# EAGLE schematic Arduino-Teensy-v421_PLUS_ESP-12E (EAGLE 8.1.0)
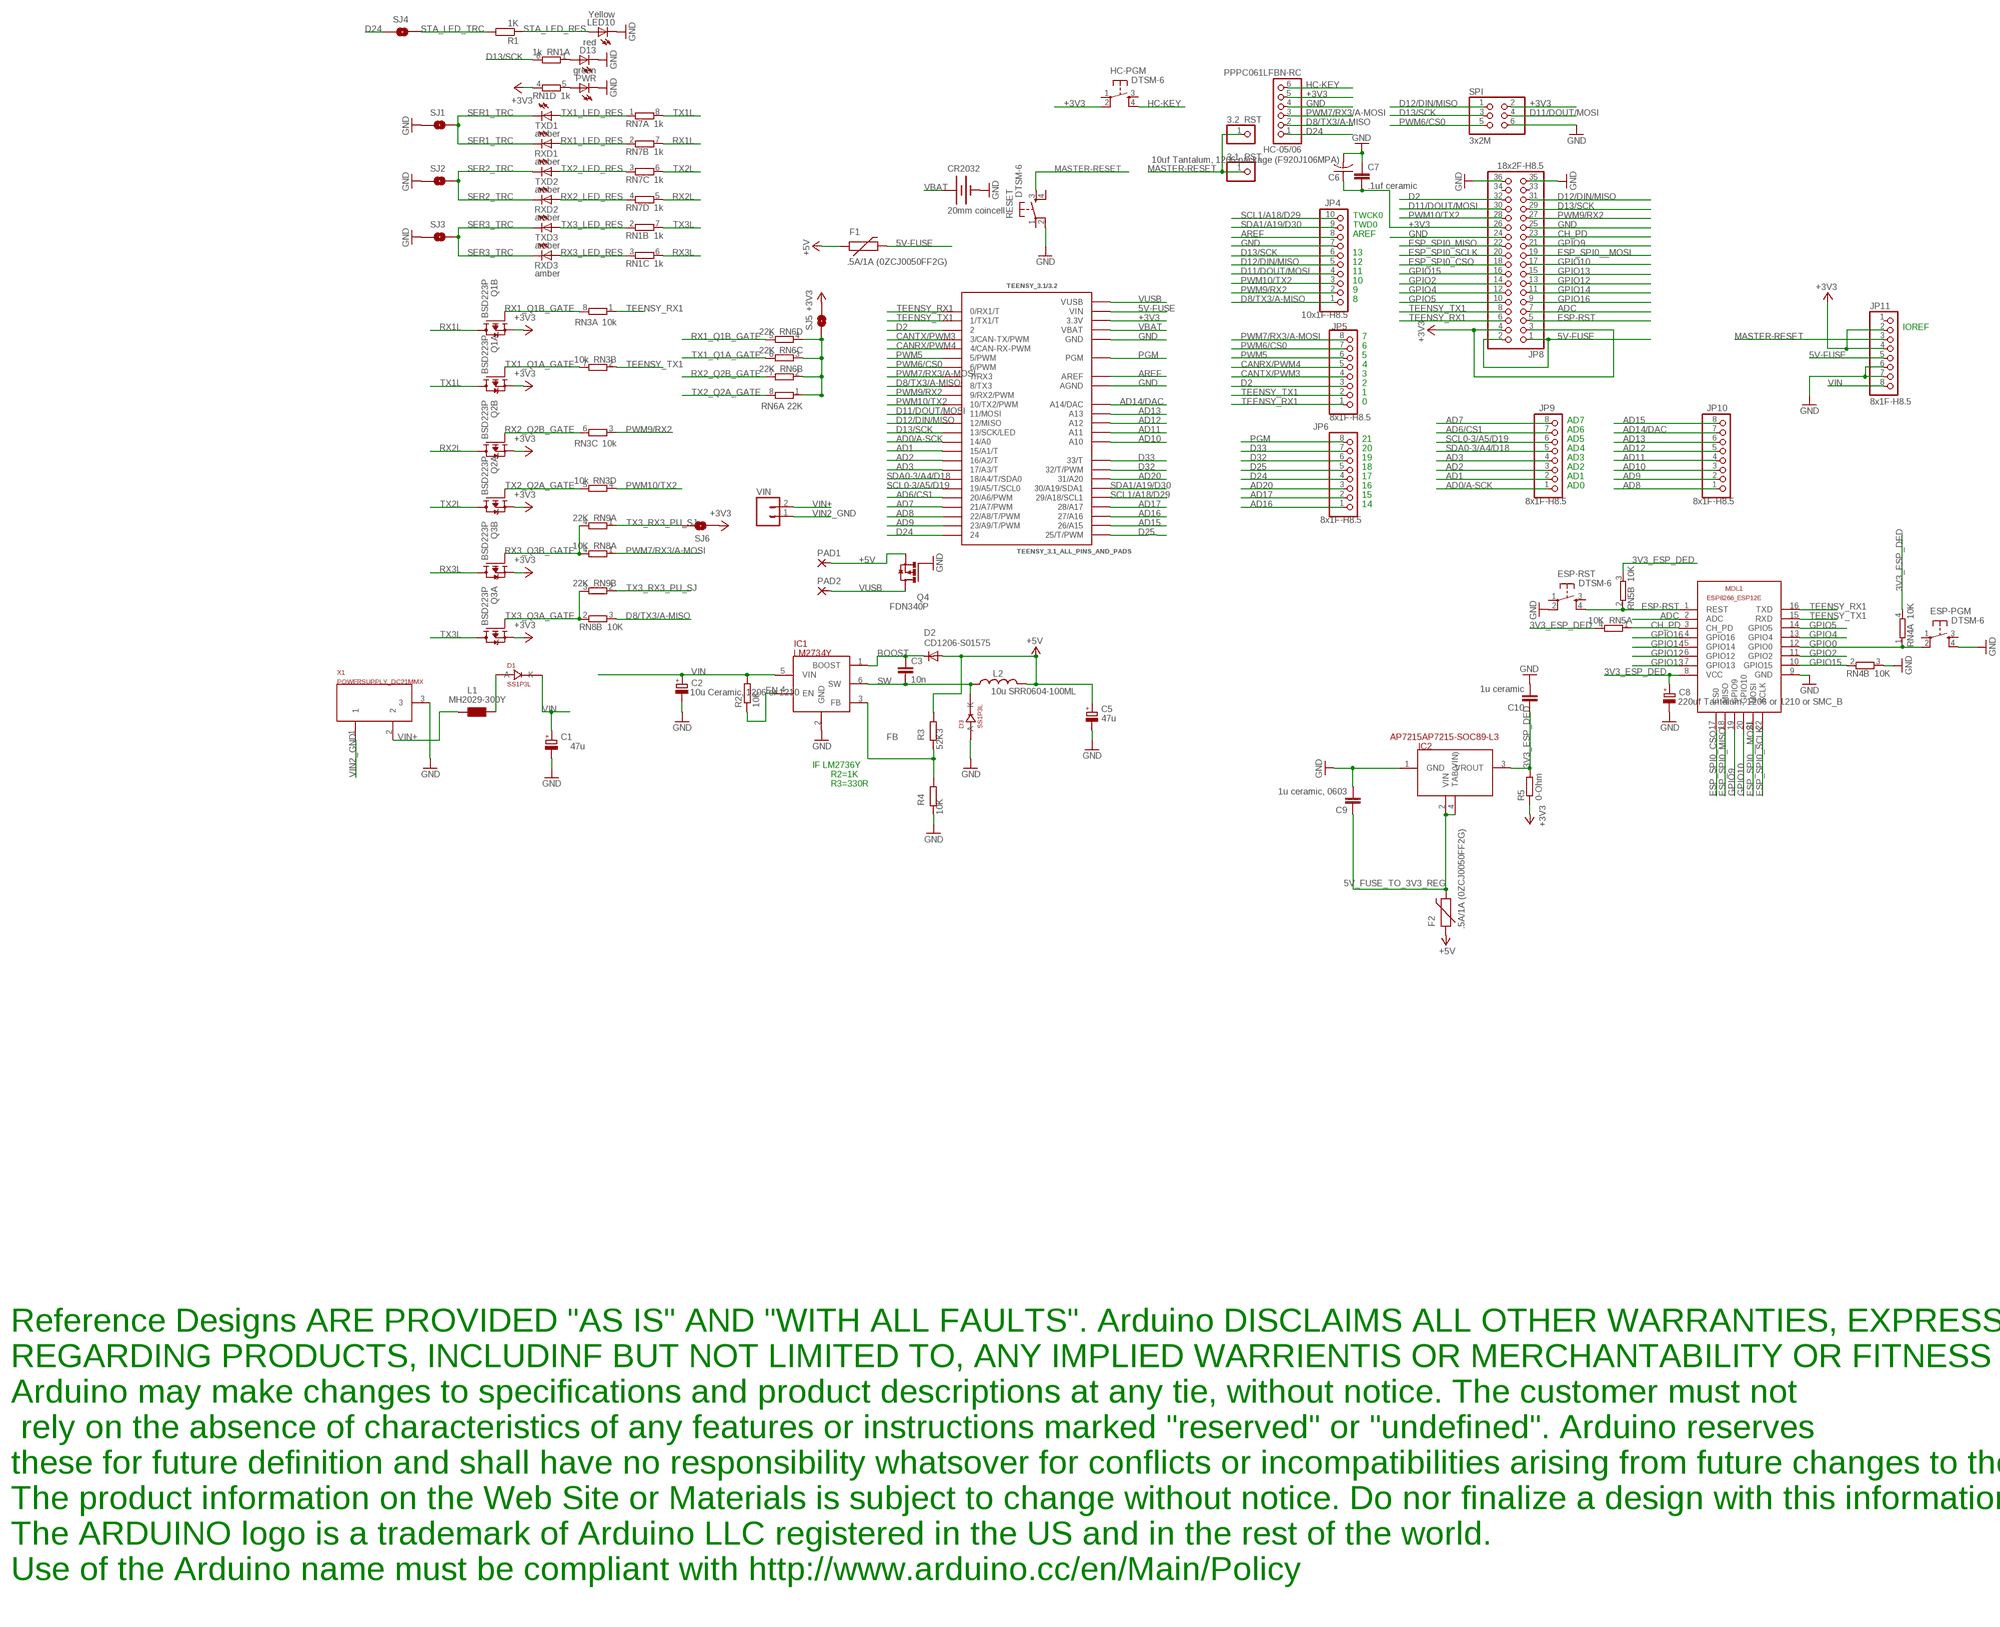
[diagram p0: schematic, sheet 1, part 1 of 2]
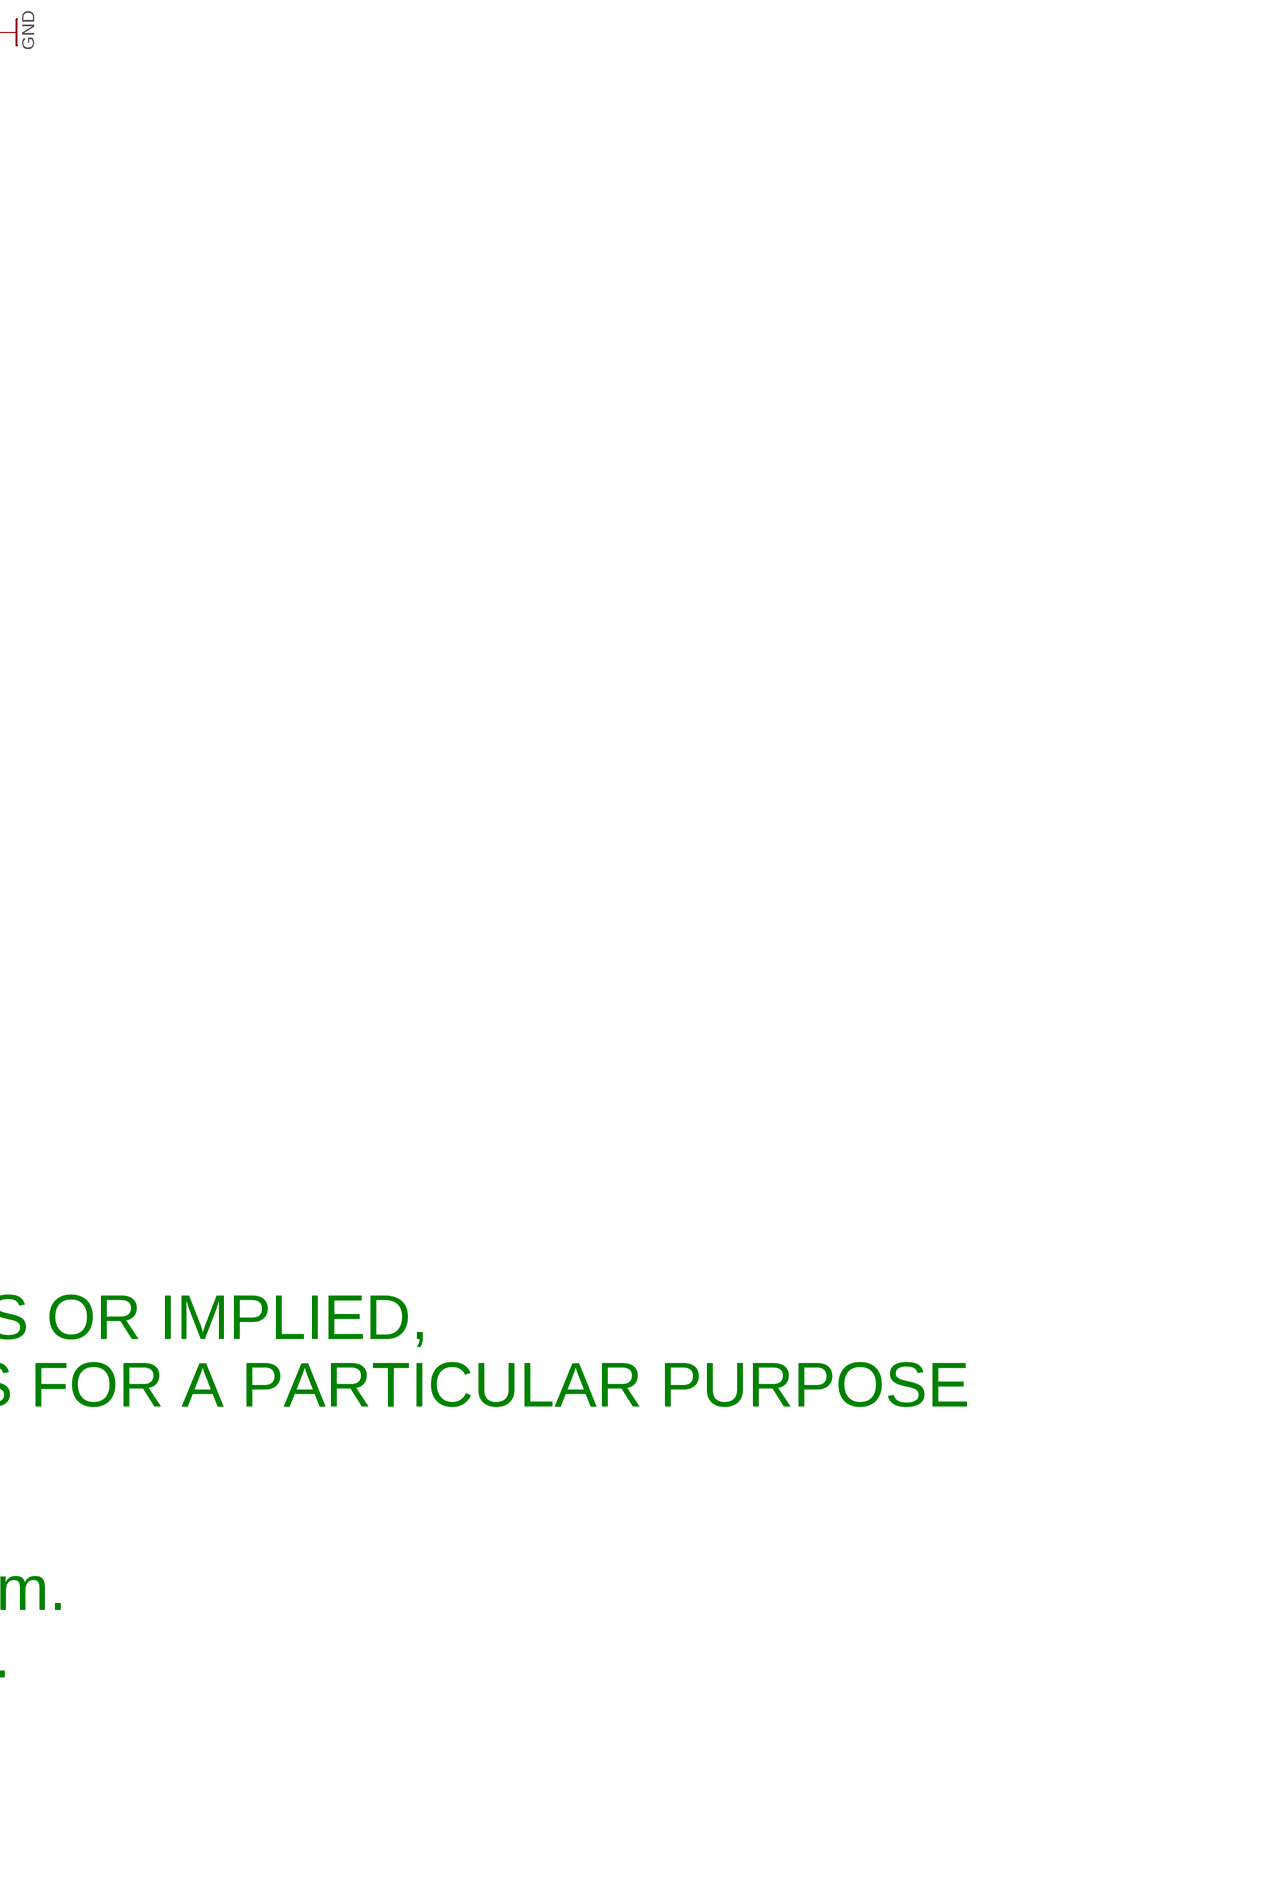
[diagram p1: schematic, sheet 1, part 2 of 2]

## Parts
3.1_RST  PINHD-1X1CB  [1X01-CLEANBIG]
3.2_RST  PINHD-1X1CB  [1X01-CLEANBIG]
C1  47u  CPOL-EUD  [PANASONIC_D]
C2  10u Ceramic, 1206 or 1210  CPOL-EUSMCB  [SMC_B]
C3  10n  C-EUC0603  [C0603-ROUND]
C5  47u  CPOL-EUD  [PANASONIC_D]
C6  10uf Tantalum, 1206 package (F920J106MPA)  C-USC0805  [C0805]
C7  .1uf ceramic  C-EUC0603  [C0603-ROUND]
C8  220uf Tantalum, 1206 or 1210 or SMC_B  CPOL-EUSMCB  [SMC_B]
C9  1u ceramic, 0603  C-EUC0603  [C0603-ROUND]
C10  1u ceramic  C-EUC0603  [C0603-ROUND]
CR2032  20mm coincell  BATTERY20MM_4LEGS  [BATTCON_20MM_4LEGS]
D1  SS1P3L  [DO220AAL]
D2  CD1206-S01575  DIODE-MINIMELF  [MINIMELF]
D3  SS1P3L  [DO220AAL]
D13  red  LEDCHIPLED_0805  [CHIPLED_0805]
ESP-PGM  DTSM-6  [DTSM-6]
ESP-RST  DTSM-6  [DTSM-6]
F1  .5A/1A (0ZCJ0050FF2G)  PTCSMD  [PTC-1206]
F2  .5A/1A (0ZCJ0050FF2G)  PTCSMD  [PTC-1206]
HC-05/06  PPPC061LFBN-RC  PINHD-1X6  [1X06]
HC-PGM  DTSM-6  [DTSM-6]
IC1  LM2734Y  LM2736Y  [SOT23-6]
IC2  AP7215AP7215-SOC89-L3  [SOC89-L3]
JP4  10x1F-H8.5  PINHD-1X10  [1X10]
JP5  8x1F-H8.5  PINHD-1X8  [1X08]
JP6  8x1F-H8.5  PINHD-1X8  [1X08]
JP8  18x2F-H8.5  PINHD-2X18  [2X18]
JP9  8x1F-H8.5  PINHD-1X8  [1X08]
JP10  8x1F-H8.5  PINHD-1X8  [1X08]
JP11  8x1F-H8.5  PINHD-1X8  [1X08]
L1  MH2029-300Y  WE-CBF_0805  [0805]
L2  10u SRR0604-100ML  L-USSRR0604  [SRR0604]
LED10  Yellow  LEDCHIPLED_0805  [CHIPLED_0805]
MDL1  ESP8266-12E)  ESP8266-12EESP8266-ESP12E  [ESP8266-ESP12E]
PAD1  SMD2  [SMD1,27-2,54]
PAD2  SMD2  [SMD1,27-2,54]
PWR  green  LEDCHIPLED_0805  [CHIPLED_0805]
Q1  BSD223P  [SOT363_INFINEON]
Q2  BSD223P  [SOT363_INFINEON]
Q3  BSD223P  [SOT363_INFINEON]
Q4  FDN340P  FDN360P  [SUPER-SOT3]
R1  1K  R-EU_R0603  [R0603]
R2  10K  R-EU_R0603  [R0603]
R3  52K3  R-EU_0603-RND  [R0603-ROUND]
R4  10K  R-EU_0603-RND  [R0603-ROUND]
R5  0-Ohm  R-EU_R0603  [R0603]
RESET  DTSM-6  [DTSM-6]
RN1  1k  4R-NCAT16  [CAT16]
RN3  10k  4R-NCAT16  [CAT16]
RN4  10K  2R-NEXB34V  [EXB34V]
RN5  10K  2R-NEXB34V  [EXB34V]
RN6  22K  4R-NCAT16  [CAT16]
RN7  1k  4R-NCAT16  [CAT16]
RN8  10K  2R-NEXB34V  [EXB34V]
RN9  22K  2R-NEXB34V  [EXB34V]
RXD1  amber  LEDCHIPLED_0805  [CHIPLED_0805]
RXD2  amber  LEDCHIPLED_0805  [CHIPLED_0805]
RXD3  amber  LEDCHIPLED_0805  [CHIPLED_0805]
SJ1  SOLDERJUMPERTRACE  [SJ_2S-TRACE]
SJ2  SOLDERJUMPERTRACE  [SJ_2S-TRACE]
SJ3  SOLDERJUMPERTRACE  [SJ_2S-TRACE]
SJ4  SOLDERJUMPERTRACE  [SJ_2S-TRACE]
SJ5  SOLDERJUMPERTRACE  [SJ_2S-TRACE]
SJ6  SOLDERJUMPERTRACE  [SJ_2S-TRACE]
SPI  3x2M  PINHD-2X3  [2X03]
TEENSY_3.1/3.2  TEENSY_3.1_ALL_PINS_AND_PADS  [TEENSY3_ALL_PINS_&_PADS]
TXD1  amber  LEDCHIPLED_0805  [CHIPLED_0805]
TXD2  amber  LEDCHIPLED_0805  [CHIPLED_0805]
TXD3  amber  LEDCHIPLED_0805  [CHIPLED_0805]
VIN  M02LOCK_LONGPADS  [1X02_LOCK_LONGPADS]
X1  POWERSUPPLY_DC21MMX  [POWERSUPPLY_DC-21MM]

## Nets
3V3_ESP_DED: C8.+ C10.1 IC2.3(VROUT) MDL1.8(VCC) R5.2 RN4.4 RN5.3 RN5.4
5V-FUSE [POWER]: F1.2 JP8.1 JP8.2 JP11.5 TEENSY_3.1/3.2.VIN
5V_FUSE_TO_3V3_REG [POWER]: C9.1 F2.2 IC2.2(VIN) IC2.4(TAB(VIN))
+3V3 [POWER]: C6.1 C7.2 HC-05/06.5 HC-PGM.2 JP8.3 JP8.4 JP8.26 JP11.2 JP11.4 Q1.1(A:S) Q1.4(B:S) Q2.1(A:S) Q2.4(B:S) Q3.1(A:S) Q3.4(B:S) R5.1 RN1.4 SJ5.2 SJ6.1 SPI.2 TEENSY_3.1/3.2.3.3V TEENSY_3.1/3.2.3.3V1(3.3V) TEENSY_3.1/3.2.3.3V2(3.3V)
+5V [POWER]: C5.+ D2.A F1.1 F2.1 L2.P$2 PAD1.1(P) Q4.2(S) R3.1
AD0/A-SCK: JP9.1 TEENSY_3.1/3.2.14/A0
AD1: JP9.2 TEENSY_3.1/3.2.15/A1(15/A1/T)
AD2: JP9.3 TEENSY_3.1/3.2.16/A2(16/A2/T)
AD3: JP9.4 TEENSY_3.1/3.2.17/A3(17/A3/T)
AD6/CS1: JP9.7 TEENSY_3.1/3.2.20/A6(20/A6/PWM)
AD7: JP9.8 TEENSY_3.1/3.2.21/A7(21/A7/PWM)
AD8: JP10.1 TEENSY_3.1/3.2.22/A8(22/A8/T/PWM)
AD9: JP10.2 TEENSY_3.1/3.2.23/A9(23/A9/T/PWM)
AD10: JP10.3 TEENSY_3.1/3.2.A10
AD11: JP10.4 TEENSY_3.1/3.2.A11
AD12: JP10.5 TEENSY_3.1/3.2.A12
AD13: JP10.6 TEENSY_3.1/3.2.A13
AD14/DAC: JP10.7 TEENSY_3.1/3.2.RESET/DAC(A14/DAC)
AD15: JP10.8 TEENSY_3.1/3.2.26(26/A15)
AD16: JP6.1 TEENSY_3.1/3.2.27(27/A16)
AD17: JP6.2 TEENSY_3.1/3.2.28(28/A17)
AD20: JP6.3 TEENSY_3.1/3.2.31(31/A20)
ADC: JP8.7 MDL1.2(ADC)
AREF: JP4.8 TEENSY_3.1/3.2.AREF
BOOST: C3.1 D2.C IC1.1(BOOST)
CANRX/PWM4: JP5.5 TEENSY_3.1/3.2.4(4/CAN-RX-PWM)
CANTX/PWM3: JP5.4 TEENSY_3.1/3.2.3(3/CAN-TX/PWM)
CH_PD: JP8.23 MDL1.3(CH_PD) RN5.1
D2: JP5.3 JP8.32 TEENSY_3.1/3.2.2
D8/TX3/A-MISO: HC-05/06.2 JP4.1 RN8.3 TEENSY_3.1/3.2.8(8/TX3)
D11/DOUT/MOSI: JP4.4 JP8.30 SPI.4 TEENSY_3.1/3.2.11(11/MOSI)
D12/DIN/MISO: JP4.5 JP8.31 SPI.1 TEENSY_3.1/3.2.12(12/MISO)
D13/SCK: JP4.6 JP8.29 RN1.8 SPI.3 TEENSY_3.1/3.2.13(13/SCK/LED)
D24: HC-05/06.1 JP6.4 SJ4.1 TEENSY_3.1/3.2.24
D25: JP6.5 TEENSY_3.1/3.2.25(25/T/PWM)
D32: JP6.6 TEENSY_3.1/3.2.32(32/T/PWM)
D33: JP6.7 TEENSY_3.1/3.2.33(33/T)
EN: IC1.4(EN) R2.1
ESP-RST: ESP-RST.4 JP8.5 MDL1.1(REST) RN5.2
ESP_SPI0__MOSI: JP8.19 MDL1.21(MOSI)
ESP_SPI0_CSO: JP8.18 MDL1.17(CS0)
ESP_SPI0_MISO: JP8.22 MDL1.18(MISO)
ESP_SPI0_SCLK: JP8.20 MDL1.22(SCLK)
FB: IC1.3(FB) R3.2 R4.1
GND: C1.- C2.- C5.- C6.2 C7.1 C8.- C9.2 C10.2 CR2032.NEGATIVE(-) D3.P$2(A) D13.C ESP-PGM.4 ESP-RST.2 HC-05/06.4 IC1.2(GND) IC2.1(GND) JP4.7 JP8.24 JP8.25 JP8.35 JP8.36 JP11.6 JP11.7 LED10.C MDL1.9(GND) PWR.C Q4.1(G) R4.2 RESET.2 RN4.3 SJ1.1 SJ2.1 SJ3.1 SPI.6 TEENSY_3.1/3.2.AGND TEENSY_3.1/3.2.GND TEENSY_3.1/3.2.GND1(GND) TEENSY_3.1/3.2.GND2(GND) X1.3
GPIO0: ESP-PGM.2 MDL1.12(GPIO0) RN4.1
GPIO2: JP8.14 MDL1.11(GPIO2)
GPIO4: JP8.12 MDL1.13(GPIO4)
GPIO5: JP8.10 MDL1.14(GPIO5)
GPIO9: JP8.21 MDL1.19(GPIO9)
GPIO10: JP8.17 MDL1.20(GPIO10)
GPIO12: JP8.13 MDL1.6(GPIO12)
GPIO13: JP8.15 MDL1.7(GPIO13)
GPIO14: JP8.11 MDL1.5(GPIO14)
GPIO15: JP8.16 MDL1.10(GPIO15) RN4.2
GPIO16: JP8.9 MDL1.4(GPIO16)
HC-KEY: HC-05/06.6 HC-PGM.4
MASTER-RESET: 3.1_RST.1 3.2_RST.1 JP11.3 RESET.3
N$2: PWR.A RN1.5
N$3: D13.A RN1.1
N$10 [POWER]: D1.P$2(A) L1.1
PGM: JP6.8 TEENSY_3.1/3.2.PGM
PWM5: JP5.6 TEENSY_3.1/3.2.5(5/PWM)
PWM6/CS0: JP5.7 SPI.5 TEENSY_3.1/3.2.6(6/PWM)
PWM7/RX3/A-MOSI: HC-05/06.3 JP5.8 RN8.1 TEENSY_3.1/3.2.7(7/RX3)
PWM9/RX2: JP4.2 JP8.27 RN3.3 TEENSY_3.1/3.2.9(9/RX2/PWM)
PWM10/TX2: JP4.3 JP8.28 RN3.4 TEENSY_3.1/3.2.10(10/TX2/PWM)
RX1_LED_RES: RN7.2 RXD1.A
RX1_Q1B_GATE: Q1.5(B:G) RN3.8 RN6.5
RX1_TX1_RX2_TX2_PU_SJ: RN6.1 RN6.2 RN6.3 RN6.4 SJ5.1
RX1L: Q1.3(B:D) RN7.7
RX2_LED_RES: RN7.4 RXD2.A
RX2_Q2B_GATE: Q2.5(B:G) RN3.6 RN6.7
RX2L: Q2.3(B:D) RN7.5
RX3_LED_RES: RN1.3 RXD3.A
RX3_Q3B_GATE: Q3.5(B:G) RN8.4 RN9.4
RX3L: Q3.3(B:D) RN1.6
SCL0-3/A5/D19: JP9.6 TEENSY_3.1/3.2.19/A5(19/A5/T/SCL0)
SCL1/A18/D29: JP4.10 TEENSY_3.1/3.2.29(29/A18/SCL1)
SDA0-3/A4/D18: JP9.5 TEENSY_3.1/3.2.18/A4(18/A4/T/SDA0)
SDA1/A19/D30: JP4.9 TEENSY_3.1/3.2.30(30/A19/SDA1)
SER1_TRC: RXD1.C SJ1.2 TXD1.C
SER2_TRC: RXD2.C SJ2.2 TXD2.C
SER3_TRC: RXD3.C SJ3.2 TXD3.C
STA_LED_RES: LED10.A R1.1
STA_LED_TRC: R1.2 SJ4.2
SW: C3.2 D3.P$1(K) IC1.6(SW) L2.P$1
TEENSY_RX1: JP5.1 JP8.6 MDL1.16(TXD) RN3.1 TEENSY_3.1/3.2.0(0/RX1/T)
TEENSY_TX1: JP5.2 JP8.8 MDL1.15(RXD) RN3.2 TEENSY_3.1/3.2.1(1/TX1/T)
TX1_LED_RES: RN7.1 TXD1.A
TX1_Q1A_GATE: Q1.2(A:G) RN3.7 RN6.6
TX1L: Q1.6(A:D) RN7.8
TX2_LED_RES: RN7.3 TXD2.A
TX2_Q2A_GATE: Q2.2(A:G) RN3.5 RN6.8
TX2L: Q2.6(A:D) RN7.6
TX3_LED_RES: RN1.2 TXD3.A
TX3_Q3A_GATE: Q3.2(A:G) RN8.2 RN9.3
TX3_RX3_PU_SJ: RN9.1 RN9.2 SJ6.2
TX3L: Q3.6(A:D) RN1.7
VBAT: CR2032.POSITIVE@1(+) CR2032.POSITIVE@2(+) CR2032.POSITIVE@3(+) CR2032.POSITIVE@4(+) TEENSY_3.1/3.2.VBAT
VIN [POWER]: C1.+ C2.+ D1.P$1(K) IC1.5(VIN) JP11.8 R2.2
VIN2_GND: VIN.1 X1.1
VIN+ [POWER]: L1.2 VIN.2 X1.2
VUSB [POWER]: PAD2.1(P) Q4.3(D) TEENSY_3.1/3.2.VUSB
Unconnected: ESP-PGM.1 ESP-PGM.3 ESP-RST.1 ESP-RST.3 HC-PGM.1 HC-PGM.3 JP8.33 JP8.34 JP11.1 RESET.1 RESET.4

## Notes on the sheet
- TWCK0
- TWD0
- AREF
- 13
- 12
- 11
- 10
- 9
- 8
- IOREF
- 7
- 6
- 5
- 4
- 3
- 2
- 1
- 0
- AD7
- AD6
- 21 | AD5
- 20 | AD4
- 19 | AD3
- 18 | AD2
- 17 | AD1
- 16 | AD0
- 15
- 14
- IF LM2736Y
- R2=1K
- R3=330R
- Reference Designs ARE PROVIDED "AS IS" AND "WITH ALL FAULTS". Arduino DISCLAIMS ALL OTHER WARRANTIES, EXPRESS OR IMPLIED,
  REGARDING PRODUCTS, INCLUDINF BUT NOT LIMITED TO, ANY IMPLIED WARRIENTIS OR MERCHANTABILITY OR FITNESS FOR A PARTICULAR PURPOSE
  Arduino may make changes to specifications and product descriptions at any tie, without notice. The customer must not
   rely on the absence of characteristics of any features or instructions marked "reserved" or "undefined". Arduino reserves
  these for future definition and shall have no responsibility whatsover for conflicts or incompatibilities arising from future changes to them.
  The product information on the Web Site or Materials is subject to change without notice. Do nor finalize a design with this information.
  The ARDUINO logo is a trademark of Arduino LLC registered in the US and in the rest of the world.
  Use of the Arduino name must be compliant with http://www.arduino.cc/en/Main/Policy

## Library data of the parts
3.1_RST 3.2_RST = adafruit:PINHD-1X1: Pin header 1x1 for 0.1" spacing With round pins
C1 C2 C5 C8 = rcl:CPOL-EU: POLARIZED CAPACITOR, European symbol
C3 C7 C9 C10 = SmartPrj:C-EU: CAPACITOR, European symbol
C6 = rcl:C-US: CAPACITOR, American symbol
CR2032 = SparkFun-Electromechanical:BATTERY: Battery Holders Various common sizes : AA, AAA, 18650 (PRT-12895), 20mm coin cell and 12mm coin cell. 20MM_4LEGS, BATT-10373; PROD_ID: BATT-10373
D1 D3 = SmartPrj:SS1P3L
D2 = diode:DIODE-: DIODE
D13 LED10 PWR RXD1-RXD3 TXD1-TXD3 = adafruit:LED: LED OSRAM: - CHIPLED LG R971, LG N971, LY N971, LG Q971, LY Q971, LO R971, LY R971 LH N974, LH R974 LS Q976, LO Q976, LY Q976 LO Q996 - Hyper CHIPLED LW Q18S LB Q993, LB Q99A, LB R99A - SideLED LS A670, LO A670, LY A670, LG A670, LP A670 LB A673, LV A673, LT A673, LW A673 LH A674 LY A675 LS A676, LA A676, LO A676, LY A676, LW A676 LS A679, LY A679, LG A679 - Hyper Micro SIDELED® LS Y876, LA Y876, LO Y876, LY Y876 LT Y87S - SmartLED LW L88C, LW L88S LB L89C, LB L89S, LG L890 LS L89K, LO L89K, LY L89K LS L896, LA L896, LO L896, LY L896 - TOPLED LS T670, LO T670, LY T670, LG T670, LP T670 LSG T670, LSP T670, LSY T670, LOP T670, LYG T670 LG T671, LOG T671, LSG T671 LB T673, LV T673, LT T673, LW T673 LH T674 LS T676, LA T676, LO T676, LY T676, LB T676, LH T676, LSB T676, LW T676 LB T67C, LV T67C, LT T67C, LS T67K, LO T67K, LY T67K, LW E67C LS E67B, LA E67B, LO E67B, LY E67B, LB E67C, LV E67C, LT E67C LW T67C LS T679, LY T679, LG T679 LS T770, LO T770, LY T770, LG T770, LP T770 LB T773, LV T773, LT T773, LW T773 LH T774 LS E675, LA E675, LY E675, LS T675 LS T776, LA T776, LO T776, LY T776, LB T776 LHGB T686 LT T68C, LB T68C - Hyper Mini TOPLED® LB M676 - Mini TOPLED Santana® LG M470 LS M47K, LO M47K, LY M47K Source: http://www.osram.convergy.de/
ESP-PGM ESP-RST HC-PGM RESET = switch-tact:DTSM-6
F1 F2 = SparkFun:PTC: Resettable Fuse PTC Resettable Fuse. Spark Fun Electronics SKU : COM-08357
HC-05/06 = pinhead:PINHD-1X6: PIN HEADER
IC1 = SmartPrj:LM2736Y
IC2 = my-custom-lib:AP7215
JP4 = SmartPrj:PINHD-1X10: PIN HEADER
JP5 JP6 JP9-JP11 = SmartPrj:PINHD-1X8: PIN HEADER
JP8 = SmartPrj:PINHD-2X18: PIN HEADER
L1 = wuerth-elektronik:WE-CBF: SMD EMI Suppression Ferrite Beads - excellent anti-EMI properties - low DCR - impedances till 3000 ohms - rated current up to 6 A
L2 = SmartPrj:L-US: INDUCTOR, American symbol
MDL1 = ESP8266-ESP12E:ESP8266-12E: ESP8266-12E with additional I/O and GPIO04/05 corrected The author cannot warrant that this library is free from error or will meet your specific requirements. Created by PuceBaboon.com. Komagane, Nagano, JAPAN
PAD1 PAD2 = wirepad:SMD2: SMD PAD
Q1-Q3 = transistor-fet:BSD223P: OptiMOS(R)-P Small-Signal-Transistor Dual P-Channel, Enhancement mode, Super Logic Level (2.5 V rated) Source: http://www.infineon.com/upload/Document/BSD223P_Rev1.3.pdf
Q4 = transistor-power:FDN360P: Single P-Channel, PowerTrench (R) MOSFET Source: http://www.fairchildsemi.com/ds/FD/FDN360P.pdf
R1 R2 R5 = rcl:R-EU_: RESISTOR, European symbol
R3 R4 = SmartPrj:R-EU_: RESISTOR, European symbol
RN1 RN3 RN6 RN7 = resistor-dil:4R-N: Array Chip Resistor Source: RS Component / Phycomp; OC_FARNELL: unknown; OC_NEWARK: unknown
RN4 RN5 RN8 RN9 = resistor-dil:2R-N: Array Chip Resistor Source: Panasonic; OC_FARNELL: unknown; OC_NEWARK: unknown
SJ1-SJ6 = SparkFun:SOLDERJUMPER: Solder Jumper Standard SMD solder jumper. Used to automate production. Two varients : Normally Open and Normally Closed are the same, but have different paste layers. NC will have a large amount of paste and should jumper during reflow.
SPI = SmartPrj:PINHD-2X3: PIN HEADER
TEENSY_3.1/3.2 = Teensy_3_and_LC_Series_Boards_v1.1:TEENSY_3.1_ALL_PINS_AND_PADS: Footprint for Teensy 3.1 or 3.2 board using all pads and all through-holes. Pads need a 2x7 0.1" SMD header.
VIN = SparkFun:M02: Header 2 Standard 2-pin 0.1" header. Use with straight break away headers (SKU : PRT-00116), right angle break away headers (PRT-00553), swiss pins (PRT-00743), machine pins (PRT-00117), and female headers (PRT-00115). Molex polarized connector foot print use with SKU : PRT-08233 with associated crimp pins and housings.
X1 = SmartPrj:POWERSUPPLY_DC21MM

## Net classes
0 default: width 0.152 mm, drill 0.305 mm, clearance 0.152 mm
1 POWER: width 0.305 mm, drill 0.305 mm, clearance 0.203 mm
2 gnd: width 0.203 mm, drill 0.406 mm, clearance 0.203 mm